# EAGLE design quasi_bb_nano_controller_3drivers (EAGLE 9.4.2)
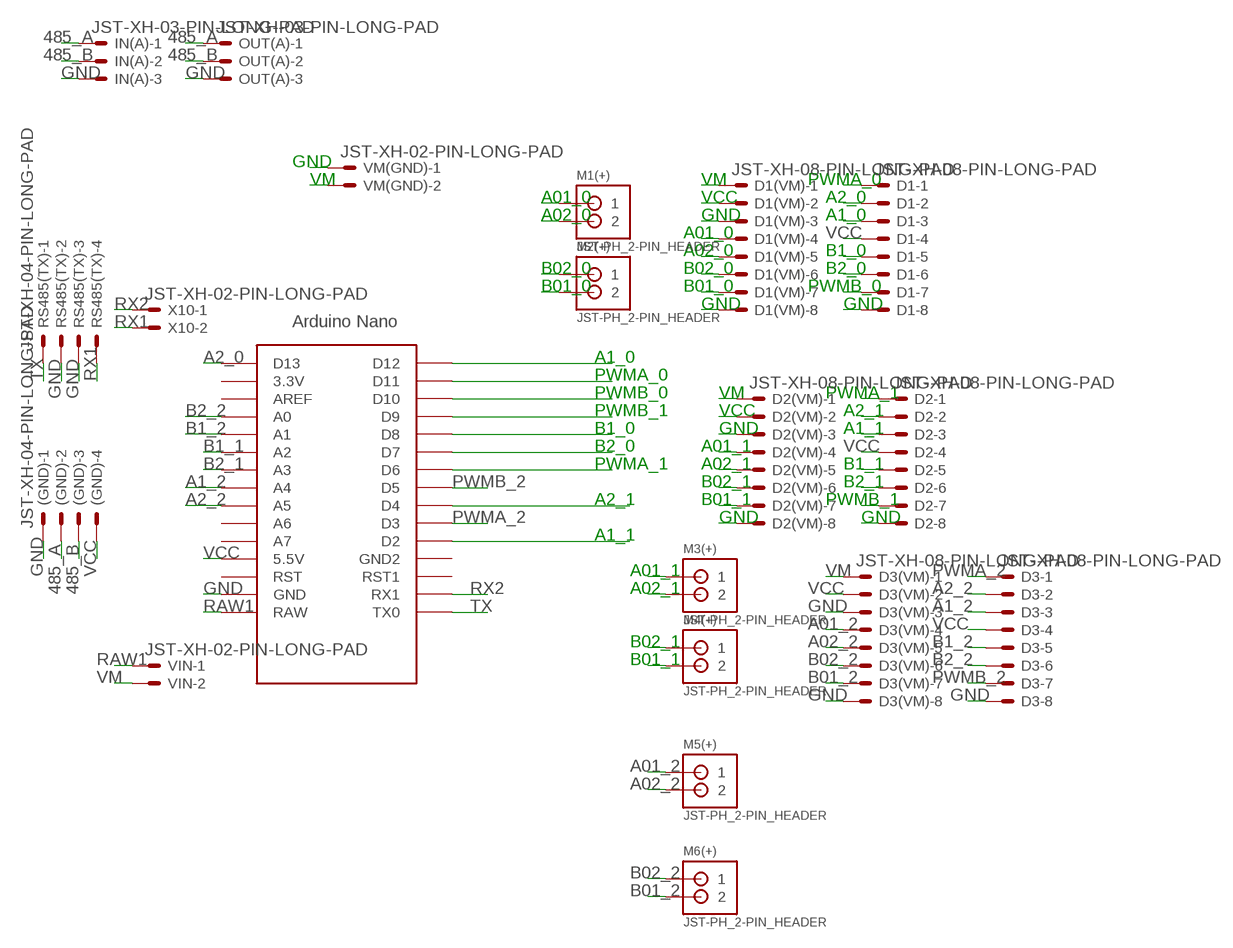
[diagram p0: schematic, sheet 1]

## Parts
(GND)  JST-XH-04-PIN-LONG-PAD  [JST-XH-04-PACKAGE-LONG-PAD]
D1  JST-XH-08-PIN-LONG-PAD  [JST-XH-08-PACKAGE-LONG-PAD]
D1(VM)  JST-XH-08-PIN-LONG-PAD  [JST-XH-08-PACKAGE-LONG-PAD]
D2  JST-XH-08-PIN-LONG-PAD  [JST-XH-08-PACKAGE-LONG-PAD]
D2(VM)  JST-XH-08-PIN-LONG-PAD  [JST-XH-08-PACKAGE-LONG-PAD]
D3  JST-XH-08-PIN-LONG-PAD  [JST-XH-08-PACKAGE-LONG-PAD]
D3(VM)  JST-XH-08-PIN-LONG-PAD  [JST-XH-08-PACKAGE-LONG-PAD]
IN(A)  JST-XH-03-PIN-LONG-PAD  [JST-XH-03-PACKAGE-LONG-PAD]
M1(+)  JST-PH_2-PIN_HEADER  [JST_B2B-PH_HEADER]
M2(+)  JST-PH_2-PIN_HEADER  [JST_B2B-PH_HEADER]
M3(+)  JST-PH_2-PIN_HEADER  [JST_B2B-PH_HEADER]
M4(+)  JST-PH_2-PIN_HEADER  [JST_B2B-PH_HEADER]
M5(+)  JST-PH_2-PIN_HEADER  [JST_B2B-PH_HEADER]
M6(+)  JST-PH_2-PIN_HEADER  [JST_B2B-PH_HEADER]
OUT(A)  JST-XH-03-PIN-LONG-PAD  [JST-XH-03-PACKAGE-LONG-PAD]
RS485(TX)  JST-XH-04-PIN-LONG-PAD  [JST-XH-04-PACKAGE-LONG-PAD]
U$1  NANO  [NANO]
VIN  JST-XH-02-PIN-LONG-PAD  [JST-XH-02-PACKAGE-LONG-PAD]
VM(GND)  JST-XH-02-PIN-LONG-PAD  [JST-XH-02-PACKAGE-LONG-PAD]
X10  JST-XH-02-PIN-LONG-PAD  [JST-XH-02-PACKAGE-LONG-PAD]

## Nets
485_A: (GND).2 IN(A).1 OUT(A).1
485_B: (GND).3 IN(A).2 OUT(A).2
A01_0: D1(VM).4 M1(+).P1
A1_0: D1.3 U$1.D12
A01_1: D2(VM).4 M3(+).P1
A1_1: D2.3 U$1.D2
A1_2: D3.3 U$1.A4
A01_2: D3(VM).4 M5(+).P1
A02_0: D1(VM).5 M1(+).P2
A2_0: D1.2 U$1.D13
A02_1: D2(VM).5 M3(+).P2
A2_1: D2.2 U$1.D4
A2_2: D3.2 U$1.A5
A02_2: D3(VM).5 M5(+).P2
B01_0: D1(VM).7 M2(+).P2
B1_0: D1.5 U$1.D8
B01_1: D2(VM).7 M4(+).P2
B1_1: D2.5 U$1.A2
B1_2: D3.5 U$1.A1
B01_2: D3(VM).7 M6(+).P2
B02_0: D1(VM).6 M2(+).P1
B2_0: D1.6 U$1.D7
B02_1: D2(VM).6 M4(+).P1
B2_1: D2.6 U$1.A3
B2_2: D3.6 U$1.A0
B02_2: D3(VM).6 M6(+).P1
GND: (GND).1 D1(VM).3 D1(VM).8 D1.8 D2(VM).3 D2(VM).8 D2.8 D3(VM).3 D3(VM).8 D3.8 IN(A).3 OUT(A).3 RS485(TX).2 RS485(TX).3 U$1.GND VM(GND).1
PWMA_0: D1.1 U$1.D11
PWMA_1: D2.1 U$1.D6
PWMA_2: D3.1 U$1.D3
PWMB_0: D1.7 U$1.D10
PWMB_1: D2.7 U$1.D9
PWMB_2: D3.7 U$1.D5
RAW1: U$1.RAW VIN.1
RX1: RS485(TX).4 X10.2
RX2: U$1.RX1 X10.1
TX: RS485(TX).1 U$1.TX0
VCC: (GND).4 D1(VM).2 D1.4 D2(VM).2 D2.4 D3(VM).2 D3.4 U$1.5V(5.5V)
VM: D1(VM).1 D2(VM).1 D3(VM).1 VIN.2 VM(GND).2
Unconnected: U$1.3.3V U$1.A6 U$1.A7 U$1.AREF U$1.GND1(GND2) U$1.ICSP1 U$1.ICSP2 U$1.ICSP3 U$1.ICSP4 U$1.ICSP5 U$1.ICSP6 U$1.RST U$1.RST1

## Library data of the parts
(GND) RS485(TX) = Rembrandt Electronics - JST XH Connectors v1-0:JST-XH-04-PIN: JST XH Connector 2 Pin Wire to board connector. Pitch: 2,54 mm, (0.100") Number of pins: 4 Created by Rembrandt Electronics www.rembrandtelectronics.com
D1 D1(VM) D2 D2(VM) D3 D3(VM) = Rembrandt Electronics - JST XH Connectors v1-0:JST-XH-08-PIN: JST XH Connector 2 Pin Wire to board connector. Pitch: 2,54 mm, (0.100") Number of pins: 8 Created by Rembrandt Electronics www.rembrandtelectronics.com
IN(A) OUT(A) = Rembrandt Electronics - JST XH Connectors v1-0:JST-XH-03-PIN: JST XH Connector 2 Pin Wire to board connector. Pitch: 2,54 mm, (0.100") Number of pins: 3 Created by Rembrandt Electronics www.rembrandtelectronics.com
M1(+) M2(+) M3(+) M4(+) M5(+) M6(+) = con-jst-ph:JST-PH_2-PIN_HEADER: 2-pin JST PH Shrouded Header, top entry P/N B2B-PH-K-S Mating connector PHR-2 Mating cable assembly: Sparkfun PRT-09914 <http://www.sparkfun.com/products/9914>
U$1 = Arduino-clone:NANO: Arduino Nano
VIN VM(GND) X10 = Rembrandt Electronics - JST XH Connectors v1-0:JST-XH-02-PIN: JST XH Connector 2 Pin Wire to board connector. Pitch: 2,54 mm, (0.100") Number of pins: 2 Created by Rembrandt Electronics www.rembrandtelectronics.com

## Board
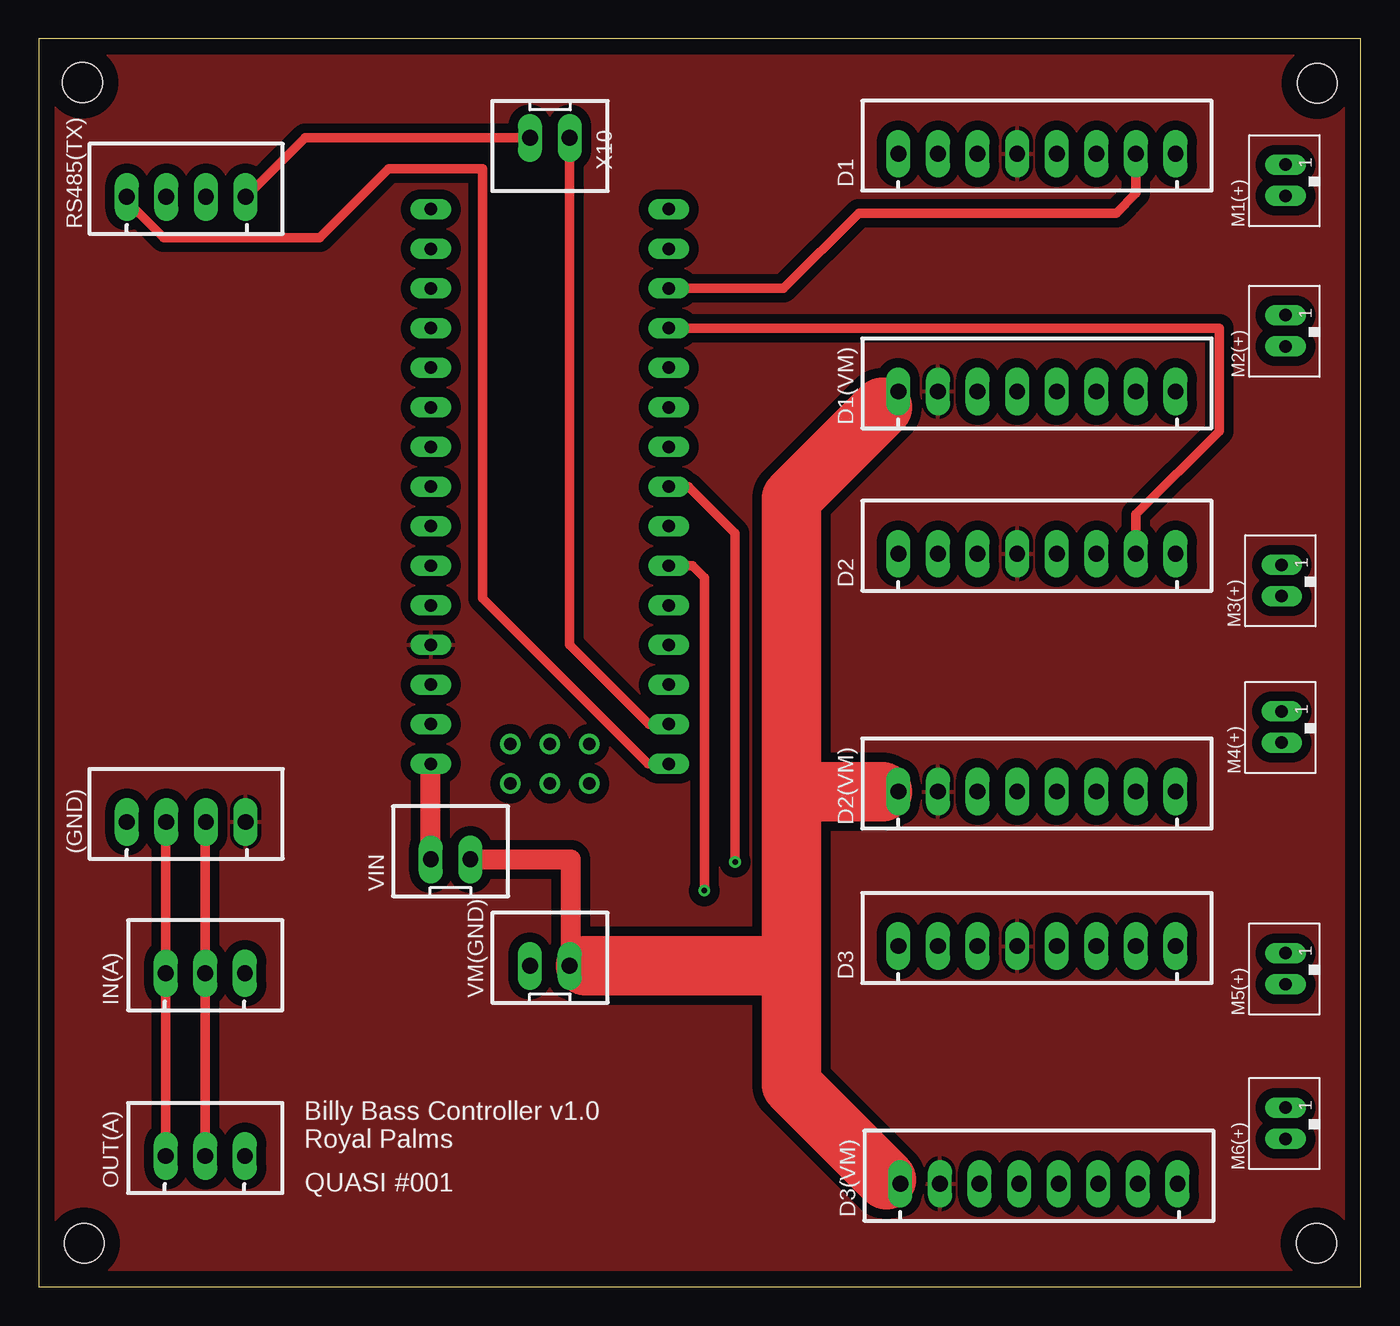
[diagram p1: board, top side]
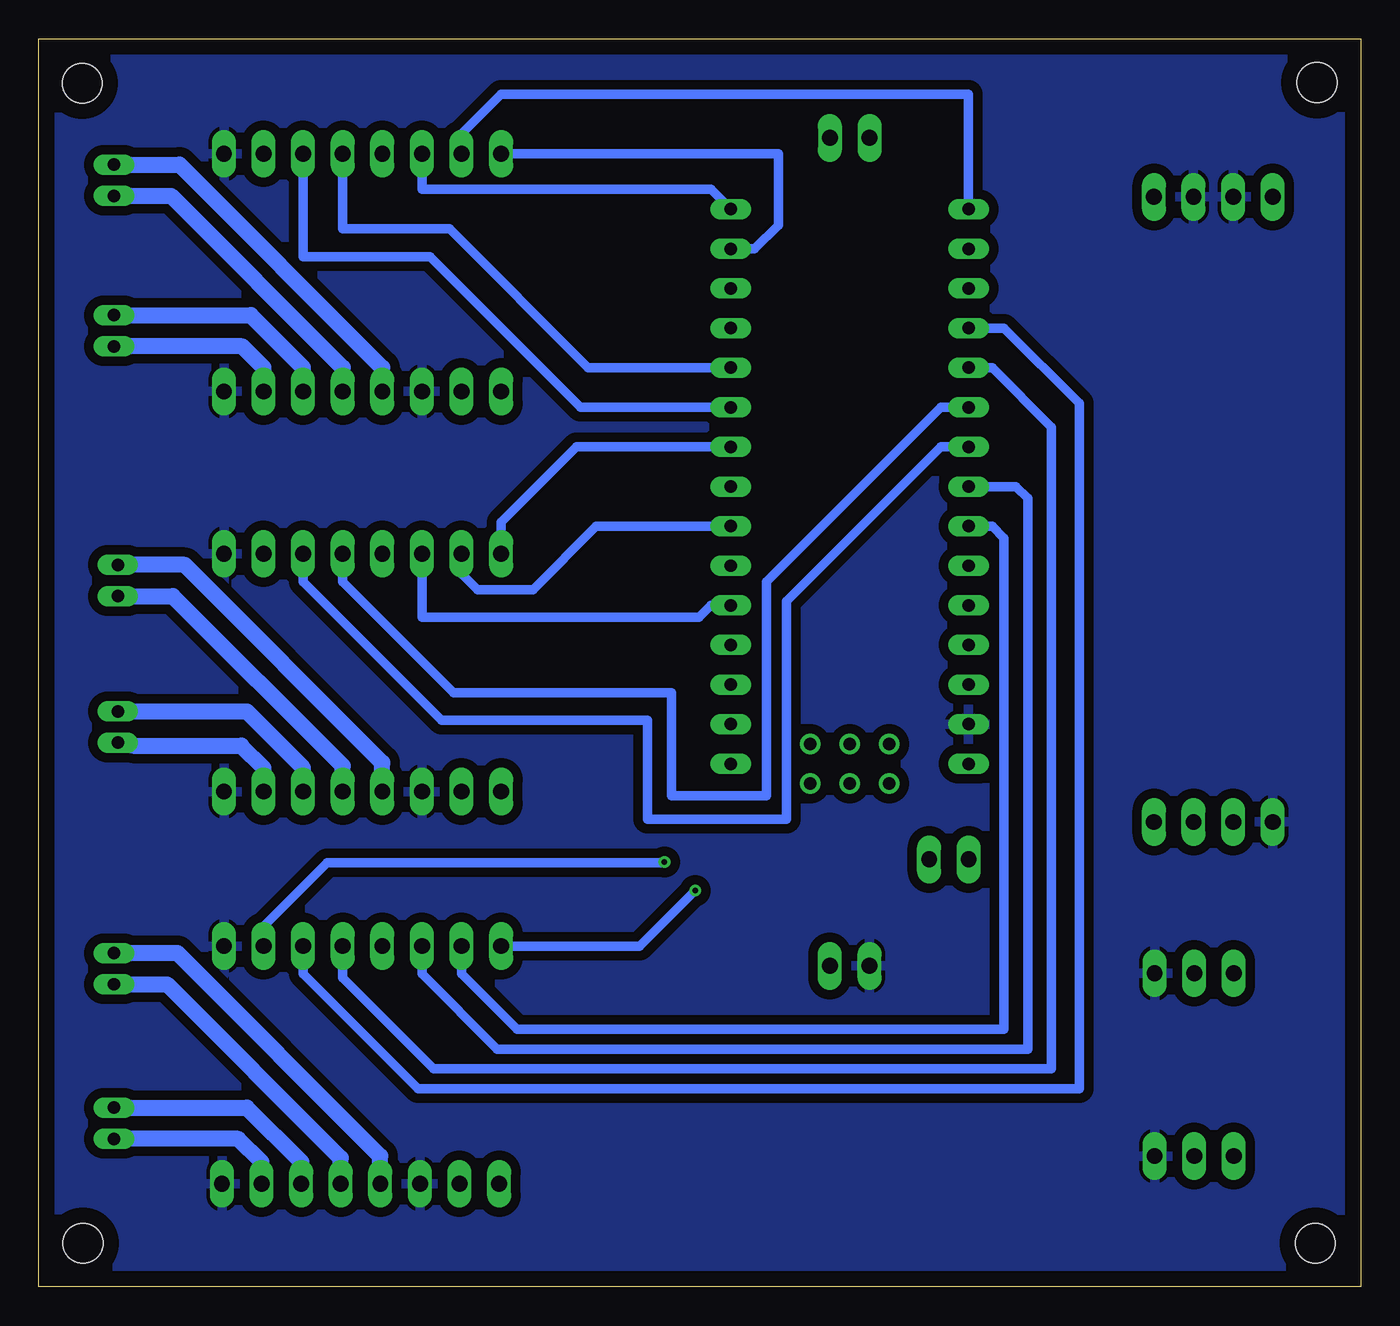
[diagram p2: board, bottom side, seen from below]

Size 84.76 x 80 mm. Coordinates in mm from the lower left corner, seen from the top.
Outline: 0,0 84.76,0 84.76,80 0,80 0,0
Copper layers (1*16): Top 0.072mm / dielectric 1.5mm / Bottom 0.072mm
Design rules "default *": minimum track width 6mil, minimum drill 0.35mm, track to track 12mil, track to pad 12mil, pad to pad 12mil, via to via 12mil, smd to smd 6mil, copper to edge 40mil, drill to drill 12mil, minimum pad ring 10mil, minimum via ring 8mil, stop-mask expansion 4mil, vias tented up to drill 0mil, thermal gap 10mil
Holes 2.54 mm at 2.79,77.22 81.99,77.16 2.89,2.79 81.93,2.79

### Footprints (pad centres in the part's own frame; a part is rotated, then mirrored left to right if it is on the bottom)
JST-XH-04-PACKAGE-LONG-PAD = drill 1.016 long: 1 -3.81,0; 2 -1.27,0; 3 1.27,0; 4 3.81,0
JST-XH-08-PACKAGE-LONG-PAD = drill 1.016 long: 1 -8.89,0; 2 -6.35,0; 3 -3.81,0; 4 -1.27,0; 5 1.27,0; 6 3.81,0; 7 6.35,0; 8 8.89,0
JST-XH-03-PACKAGE-LONG-PAD = drill 1.016 long: 1 -2.54,0; 2 0,0; 3 2.54,0
JST_B2B-PH_HEADER = drill 0.8 long: P1 1.075,0.048; P2 -0.925,0.048
NANO = drill 0.8 long: 3.3V -10.16,24.13; 5V -10.16,-1.27; A0 -10.16,19.05; A1 -10.16,16.51; A2 -10.16,13.97; A3 -10.16,11.43; A4 -10.16,8.89; A5 -10.16,6.35; A6 -10.16,3.81; A7 -10.16,1.27; AREF -10.16,21.59; D2 5.08,1.27; D3 5.08,3.81; D4 5.08,6.35; D5 5.08,8.89; D6 5.08,11.43; D7 5.08,13.97; D8 5.08,16.51; D9 5.08,19.05; D10 5.08,21.59; D11 5.08,24.13; D12 5.08,26.67; D13 -10.16,26.67; GND -10.16,-6.35; GND1 5.08,-1.27; RAW -10.16,-8.89; RST -10.16,-3.81; RST1 5.08,-3.81; RX1 5.08,-6.35; TX0 5.08,-8.89 | drill 0.8: ICSP1 -5.08,-10.16; ICSP2 -5.08,-7.62; ICSP3 -2.54,-10.16; ICSP4 -2.54,-7.62; ICSP5 0,-10.16; ICSP6 0,-7.62
JST-XH-02-PACKAGE-LONG-PAD = drill 1.016 long: 1 -1.27,0; 2 1.27,0

### Placement (x,y rotation side)
(GND)  9.44,29.8 0 top
D1  64.01,72.64 0 top
D1(VM)  64.01,57.4 0 top
D2  64.01,46.99 0 top
D2(VM)  64.01,31.75 0 top
D3  64.01,21.84 0 top
D3(VM)  64.14,6.6 0 top
IN(A)  10.67,20.1 0 top
M1(+)  80.01,70.87 90 top
M2(+)  80.01,61.21 90 top
M3(+)  79.76,45.21 90 top
M4(+)  79.76,35.81 90 top
M5(+)  80.01,20.32 90 top
M6(+)  80.01,10.41 90 top
OUT(A)  10.67,8.38 0 top
RS485(TX)  9.44,69.88 0 top
U$1  35.31,42.42 0 top
VIN  26.4,27.4 0 top
VM(GND)  32.77,20.57 0 top
X10  32.77,73.66 180 top

### Tracks (layer width: path | path; a pad name or v marks a point on that pad's centre or on a via)
485_A
  Top 0.61: OUT(A).1 IN(A).1 8.13,29.8 (GND).2
485_B
  Top 0.61: OUT(A).2 IN(A).2 10.67,29.72 10.71,29.76 (GND).3
A01_0
  Bottom 1.016: D1(VM).4 62.74,58.93 75.75,71.94 M1(+).P1
A1_0
  Bottom 0.61: D1.3 60.2,70.36 41.66,70.36 U$1.D12
A01_1
  Bottom 0.61: 62.74,33.54 75.42,46.29
  Bottom 1.016: D2(VM).4 62.74,33.54 62.74,33.61 75.42,46.29 M3(+).P1
A1_1
  Bottom 0.61: D2.3 60.2,42.93 42.42,42.93 41.66,43.69 U$1.D2
A1_2
  Bottom 0.61: D3.3 60.2,20.07 55.37,15.24 21.34,15.24 21.34,50.55 22.1,51.31 U$1.A4
A01_2
  Bottom 1.016: D3(VM).4 62.87,8.38 75.88,21.39 M5(+).P1
A02_0
  Bottom 1.016: D1(VM).5 65.28,58.93 76.29,69.94 M1(+).P2
A2_0
  Bottom 0.61: U$1.D13 25.15,76.45 55.12,76.45 57.66,73.91 D1.2
A02_1
  Bottom 1.016: M3(+).P2 76.17,44.29 65.28,33.39 D2(VM).5
A2_1
  Bottom 0.61: D2.2 57.66,45.72 56.64,44.7 53.09,44.7 49.02,48.77 U$1.D4
A2_2
  Bottom 0.61: D3.2 57.66,20.07 54.1,16.51 22.86,16.51 22.86,48.01 23.62,48.77 U$1.A5
A02_2
  Bottom 1.016: M5(+).P2 76.55,19.39 65.41,8.26 D3(VM).5
B01_0
  Bottom 1.016: D1(VM).7 70.36,58.93 71.72,60.29 M2(+).P2
B1_0
  Bottom 0.61: U$1.D8 49.53,58.93 58.42,67.82 65.28,67.82 D1.5
B01_1
  Bottom 1.016: D2(VM).7 70.36,33.27 71.78,34.7 78.75,34.7 78.95,34.89 M4(+).P2
B1_1
  Bottom 0.61: D2.5 65.28,45.21 58.17,38.1 44.2,38.1 44.2,31.5 38.1,31.5 38.1,45.21 26.92,56.39 U$1.A2
B1_2
  Bottom 0.61: D3.5 65.28,19.81 59.44,13.97 19.81,13.97 19.81,55.12 23.62,58.93 U$1.A1
B01_2
  Bottom 1.016: D3(VM).7 70.48,8 71.97,9.49 M6(+).P2
B02_0
  Bottom 1.016: M2(+).P1 71.18,62.29 67.82,58.93 D1(VM).6
B2_0
  Bottom 0.61: U$1.D7 50.04,56.39 59.69,66.04 67.82,66.04 D1.6
B02_1
  Bottom 1.016: M4(+).P1 71.43,36.89 67.82,33.27 D2(VM).6
B2_1
  Bottom 0.61: D2.6 67.82,45.21 58.93,36.32 45.72,36.32 45.72,29.97 36.83,29.97 36.83,43.94 26.92,53.85 U$1.A3
B2_2
  Bottom 0.61: D3.6 67.82,20.07 60.45,12.7 18.03,12.7 18.03,56.64 22.86,61.47 U$1.A0
B02_2
  Bottom 1.016: M6(+).P1 71.43,11.49 67.94,8 D3(VM).6
GND
  pour Bottom (isolate 0.61): -9.91,88.9 -9.91,-35.56 9.4,-54.86 126.49,-54.86 126.49,88.9
PWMA_0
  Bottom 0.61: U$1.D11 38.86,66.55 37.34,68.07 37.34,72.64 D1.1
PWMA_1
  Bottom 0.61: U$1.D6 50.29,53.85 55.12,49.02 D2.1
PWMA_2  (via drill 0.35)
  Top 0.61: U$1.D3 41.91,46.23 42.67,45.47 v42.67,25.4
  Bottom 0.61: v42.67,25.4 46.23,21.84 D3.1
PWMB_0
  Top 0.61: D1.7 70.36,70.1 69.09,68.83 52.58,68.83 47.75,64.01 U$1.D10
PWMB_1
  Top 0.61: D2.7 70.36,49.53 75.69,54.86 75.69,61.47 U$1.D9
PWMB_2  (via drill 0.35)
  Top 0.61: U$1.D5 41.66,51.31 44.64,48.32 v44.64,27.23
  Bottom 0.61: D3.7 70.36,23.11 66.29,27.18 44.7,27.18 v44.64,27.23
RAW1
  Top 0.61: 25.13,33.51 U$1.RAW
  Top 1.27: VIN.1 25.13,33.51
RX1
  Top 0.61: X10.2 17.06,73.66 13.28,69.88 RS485(TX).4
RX2
  Top 0.61: U$1.RX1 39.12,36.07 34.04,41.15 X10.1
TX
  Top 0.61: U$1.TX0 39.06,33.53 28.45,44.14 28.45,71.67 22.42,71.67 18,67.25 8,67.25 5.63,69.62 RS485(TX).1
VCC
  pour Top (isolate 0.61): -4.83,84.58 133.35,84.58 133.35,-57.15 -4.83,-57.15
VM
  Top 0.61: D2(VM).1 54.1,31.75 | D1(VM).1 54.1,56.39
  Top 1.016: 35.05,20.57 VM(GND).2 | 54.36,6.86 55.24,5.97 D3(VM).1
  Top 1.27: VIN.2 34.1,27.4 34.1,20.64 VM(GND).2
  Top 2.54: 48.26,13.59 48.26,20.32 48.26,31.75
  Top 3.81: 48.26,20.32 48.01,20.57 35.05,20.57 | 48.26,31.75 48.26,13.59 48.26,12.95 54.36,6.86 | 48.26,31.75 48.26,50.55 54.1,56.39 | 54.1,31.75 48.26,31.75

### Text on the board
tNames: Billy Bass Controller v1.0 / Royal Palms | QUASI #001